# Altium schematic sheet Power.SchDoc
size A4
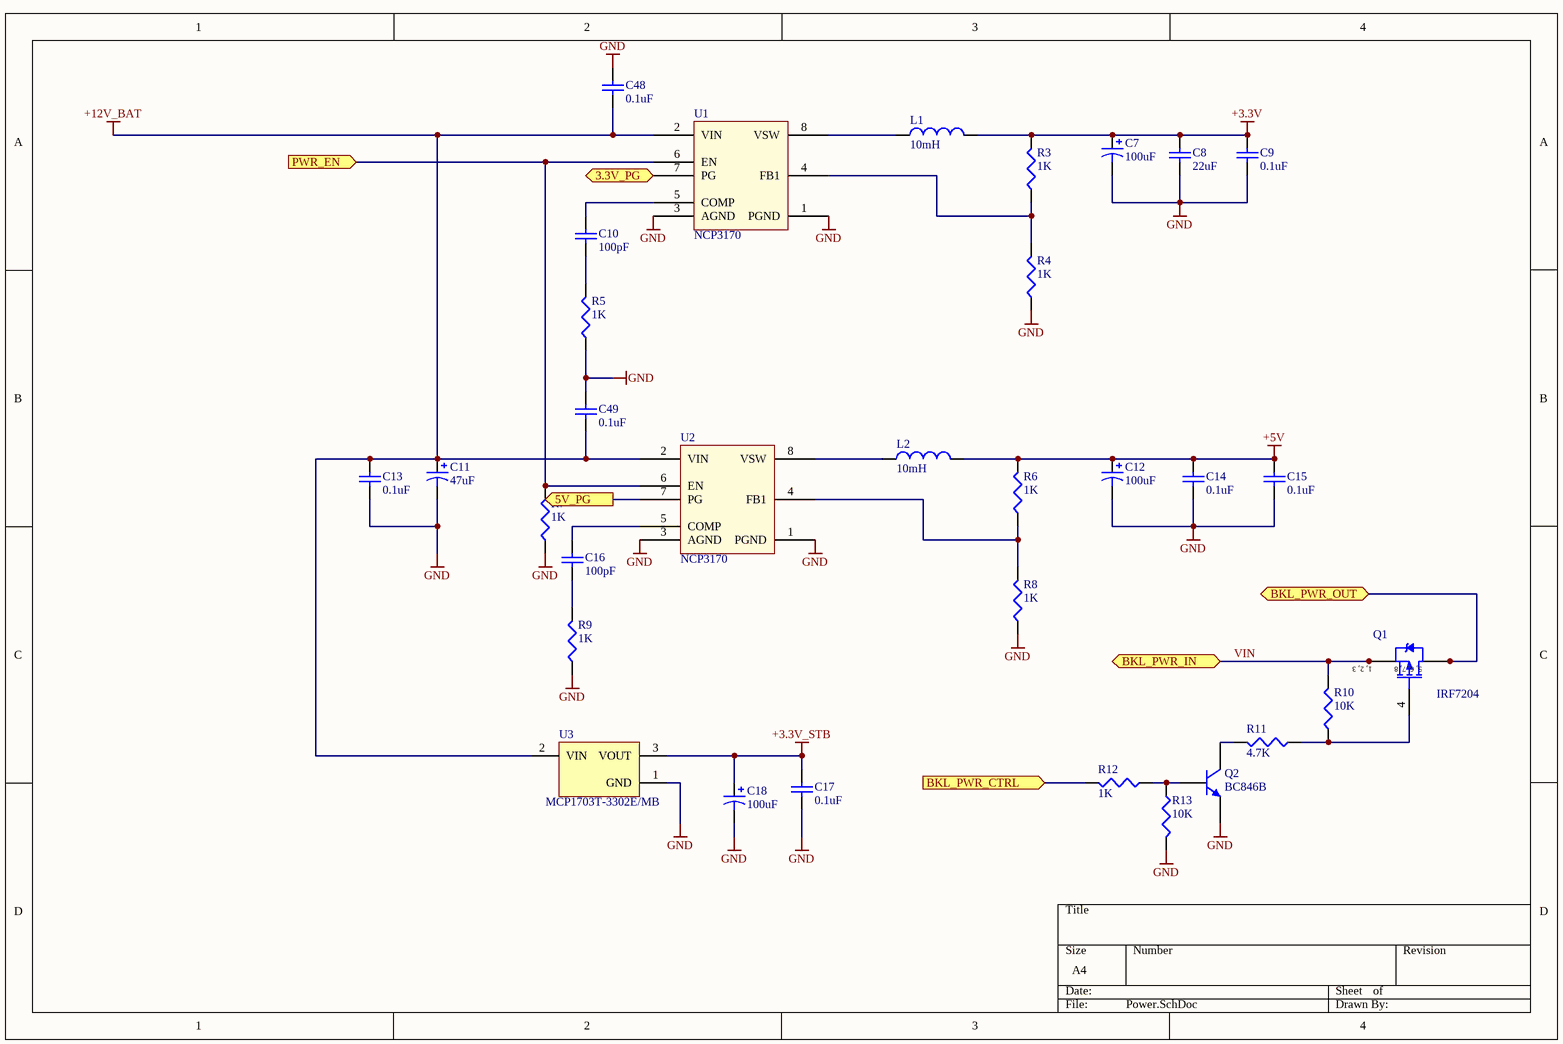
[diagram p0: Power.SchDoc]

## Parts
C7  100uF  [6032]
C8  22uF  [2012[0805]]
C9  0.1uF  [2012[0805]]
C10  100pF  [1608[0603]]
C11  47uF  [7343]
C12  100uF  [6032]
C13  0.1uF  [2012[0805]]
C14  0.1uF  [2012[0805]]
C15  0.1uF  [2012[0805]]
C16  100pF  [1608[0603]]
C17  0.1uF  [2012[0805]]
C18  100uF  [6032]
C48  0.1uF  [2012[0805]]
C49  0.1uF  [2012[0805]]
L1  10mH  [CDRH127]
L2  10mH  [CDRH127]
Q1  IRF7204  [SO-8_N]
Q2  BC846B  [SOT23_N]
R3  1K  [R2012[0805]]
R4  1K  [R2012[0805]]
R5  1K  [R1608[0603]]
R6  1K  [R2012[0805]]
R7  1K  [R1608[0603]]
R8  1K  [R2012[0805]]
R9  1K  [R1608[0603]]
R10  10K  [R2012[0805]]
R11  4.7K  [R2012[0805]]
R12  1K  [R2012[0805]]
R13  10K  [R2012[0805]]
U1  NCP3170  [SOIC127P600-8AM]
U2  NCP3170  [SOIC127P600-8AM]
U3  MCP1703T-3302E/MB  [SOT-89-MB3_N]

## Ports
3.3V_PG (out), 5V_PG (out), BKL_PWR_CTRL (in), BKL_PWR_IN, BKL_PWR_OUT, PWR_EN (in)

## Nets
+3.3V: C7.1 C8.2 C9.2 L1.2 R3.2
+3.3V_STB: C17.2 C18.1 U3.3(VOUT)
+5V: C12.1 C14.2 C15.2 L2.2 R6.2
+12V_BAT: C11.1 C13.2 C48.1 C49.1 U1.2(VIN) U2.2(VIN) U3.2(VIN)
GND: C7.2 C8.1 C9.1 C11.2 C12.2 C13.1 C14.1 C15.1 C17.1 C18.2 C48.2 C49.2 Q2.2(E) R4.1 R5.1 R7.1 R8.1 R9.1 R13.2 U1.1(PGND) U1.3(AGND) U2.1(PGND) U2.3(AGND) U3.1(GND)
3.3V_PG: U1.7(PG) ; port 3.3V_PG
5V_PG: U2.7(PG) ; port 5V_PG
BKL_PWR_CTRL: R12.2 ; port BKL_PWR_CTRL
BKL_PWR_OUT: Q1.5(D) Q1.6(D) Q1.7(D) Q1.8(D) ; port BKL_PWR_OUT
PWR_EN: R7.2 U1.6(EN) U2.6(EN) ; port PWR_EN
VIN: Q1.1(S) Q1.2(S) Q1.3(S) R10.2 ; port BKL_PWR_IN
NetC10_1: C10.1 R5.2
NetC10_2: C10.2 U1.5(COMP)
NetC16_1: C16.1 R9.2
NetC16_2: C16.2 U2.5(COMP)
NetL1_1: L1.1 U1.8(VSW)
NetL2_1: L2.1 U2.8(VSW)
NetQ1_4: Q1.4(G) R10.1 R11.1
NetQ2_1: Q2.1(B) R12.1 R13.1
NetQ2_3: Q2.3(C) R11.2
NetR3_1: R3.1 R4.2 U1.4(FB1)
NetR6_1: R6.1 R8.2 U2.4(FB1)

## Notes on the sheet
- (in symbol IRF7204) 1, 2, 3; 5, 6, 7, 8

## Library data of the parts
C7 C12 C18 = 893D225X0025C2: Tantamount Built-In-Fuse Miniature, Molded-Case Solid Tantalum Chip Capacitor: 2.2uF, 20% Tolerance, 25 WVDC @ +85°C, Surge = 32V; Note: See Data Sheet for full range of components; Published: 19-Mar-2004; DatasheetDocument: 04-Feb-2003; PackageReference: 6032; Publisher: Altium Limited; Code_JEITA: 6032; ComponentLink1Description: Manufacturer Link; ComponentLink1URL: http://www.vishay.com/; ComponentLink2Description: Datasheet; ComponentLink2URL: http://www.vishay.com/docs/40008/893d.pdf; Value: 100uF
C8 C9 C13-C15 C17 C48 C49 = C0805: Ceramic Chip Capacitor - Standard; Note: Footprint corresponds to dimensions for bulk cassette packaging. This case size has tightened tolerances.; Published: 17-Jul-2002; LatestRevisionDate: 19-Mar-2004; LatestRevisionNote: Silkscreen size reduced.; DatasheetDocument: Mar-2001; PackageDocument: Mar-2001; PackageReference: 0805; Publisher: Altium Limited; Code_JEITA: 0805; Code_IPC: 2012[0805]; ComponentLink1Description: Manufacturer Link; ComponentLink1URL: http://www.kemet.com/; ComponentLink2Description: Datasheet; ComponentLink2URL: http://www.kemet.com/kemet/web/homepage/kechome.nsf/vapubfilesname/F3102TA.pdf/$file/F3102TA.pdf
  C8: Value: 22uF
  C9 C13-C15 C17 C48 C49: Value: 0.1uF
C10 C16 = C0603: Ceramic Chip Capacitor - Standard; Note: Footprint corresponds to dimensions for bulk cassette packaging. This case size has tightened tolerances.; Published: 17-Jul-2002; LatestRevisionDate: 19-Mar-2004; LatestRevisionNote: Silkscreen size reduced.; DatasheetDocument: Mar-2001; PackageDocument: Mar-2001; PackageReference: 0603; Publisher: Altium Limited; Code_JEITA: 0603; Code_IPC: 1608 [0603]; ComponentLink1Description: Manufacturer Link; ComponentLink1URL: http://www.kemet.com/; ComponentLink2Description: Datasheet; ComponentLink2URL: http://www.kemet.com/kemet/web/homepage/kechome.nsf/vapubfilesname/F3102TA.pdf/$file/F3102TA.pdf; Value: 100pF
C11 = 893D156X0025D2: Tantamount Built-In-Fuse Miniature, Molded-Case Solid Tantalum Chip Capacitor: 15uF, 20% Tolerance, 25 WVDC @ +85°C, Surge = 32V; Note: See Data Sheet for full range of components; Published: 19-Mar-2004; DatasheetDocument: 04-Feb-2003; PackageReference: 7343; Publisher: Altium Limited; Code_JEITA: 7343; ComponentLink1Description: Manufacturer Link; ComponentLink1URL: http://www.vishay.com/; ComponentLink2Description: Datasheet; ComponentLink2URL: http://www.vishay.com/docs/40008/893d.pdf; Value: 47uF
L1 L2 = Inductor: Code_IEC: 1005; Published: 8-Jun-2000; LatestRevisionDate: 29-May-2009; LatestRevisionNote: IPC-7351 Footprint Added.; PackageReference: 0402-A; Publisher: Altium Limited; PackageDescription: Chip Inductor; Code_JEITA: 0402; Value: 10mH
Q1 = IRF7204: HEXFET Power MOSFET; Published: 8-Jun-2000; LatestRevisionDate: 13-Apr-2006; LatestRevisionNote: IPC-7351 Footprint Added.; DatasheetVersion: Aug-1997; PackageVersion: Feb-2001; PackageReference: SO-8; Publisher: Altium Limited; PackageDescription: 8-Pin Plastic Small Outline Integrated Circuit 1.27 mm Pitch; Code_JEDEC: MS-012-AA; Code_IPC: SOIC127P600-8; ComponentLink1Description: Manufacturer Link; ComponentLink1URL: http://www.irf.com/; ComponentLink2Description: Datasheet; ComponentLink2URL: http://www.irf.com/product-info/datasheets/data/irf7204.pdf
Q2 = BC846B: NPN General-purpose Transistor; Published: 17-Sep-2003; LatestRevisionDate: 12-Dec-2006; LatestRevisionNote: IPC-7351 Footprint Added.; DatasheetVersion: 4-Feb-2002; PackageVersion: May-1999; PackageReference: SOT23; Publisher: Altium Limited; PackageDescription: 3-Pin SOT-23 Package 0.95 mm Pitch, 2.3 mm Lead Span; ComponentLink1Description: Manufacturer Link; ComponentLink1URL: http://www.semiconductors.philips.com/; ComponentLink2Description: Datasheet; ComponentLink2URL: http://www.semiconductors.philips.com/acrobat/datasheets/BC846_BC847_BC848_5.pdf
R3 R4 R6 R8 R10-R13 = R0805: Published: 8-Jun-2000; LatestRevisionDate: 29-May-2009; LatestRevisionNote: IPC-7351 Footprint Added.; PackageReference: J1-0603; Publisher: Altium Limited; PackageDescription: Chip Resistor
  R3 R4 R6 R8 R12: Value: 1K
  R10 R13: Value: 10K
  R11: Value: 4.7K
R5 R7 R9 = R0603: Published: 8-Jun-2000; LatestRevisionDate: 29-May-2009; LatestRevisionNote: IPC-7351 Footprint Added.; PackageReference: J1-0603; Publisher: Altium Limited; PackageDescription: Chip Resistor; Value: 1K
U1 U2 = TCP3170
U3 = MCP1703T-3302E/MB: 250 mA, 16V, Low Quiescent Current LDO Regulator, 3-Pin SOT-89, Extended Temperature, Tape and Reel; DatasheetVersion: revD, Sep-2009; PackageVersion: revBB, Aug-2009; PackageReference: SOT-89-MB3; PackageDescription: 3-Lead Plastic Small Outline Transistor Header (MB) [SOT-89]; Code_IPC: SOT89; ComponentLink1Description: Manufacturer URL; ComponentLink1URL: http://www.microchip.com/; ComponentLink2Description: Datasheet; ComponentLink2URL: http://ww1.microchip.com/downloads/en/DeviceDoc/22049d.pdf; ComponentLink3Description: Package Specification; ComponentLink3URL: http://www.microchip.com/stellent/groups/techpub_sg/documents/packagingspec/en012702.pdf